# EAGLE design Monitor (EAGLE 7.7.0)

## Sheet 1 of 2
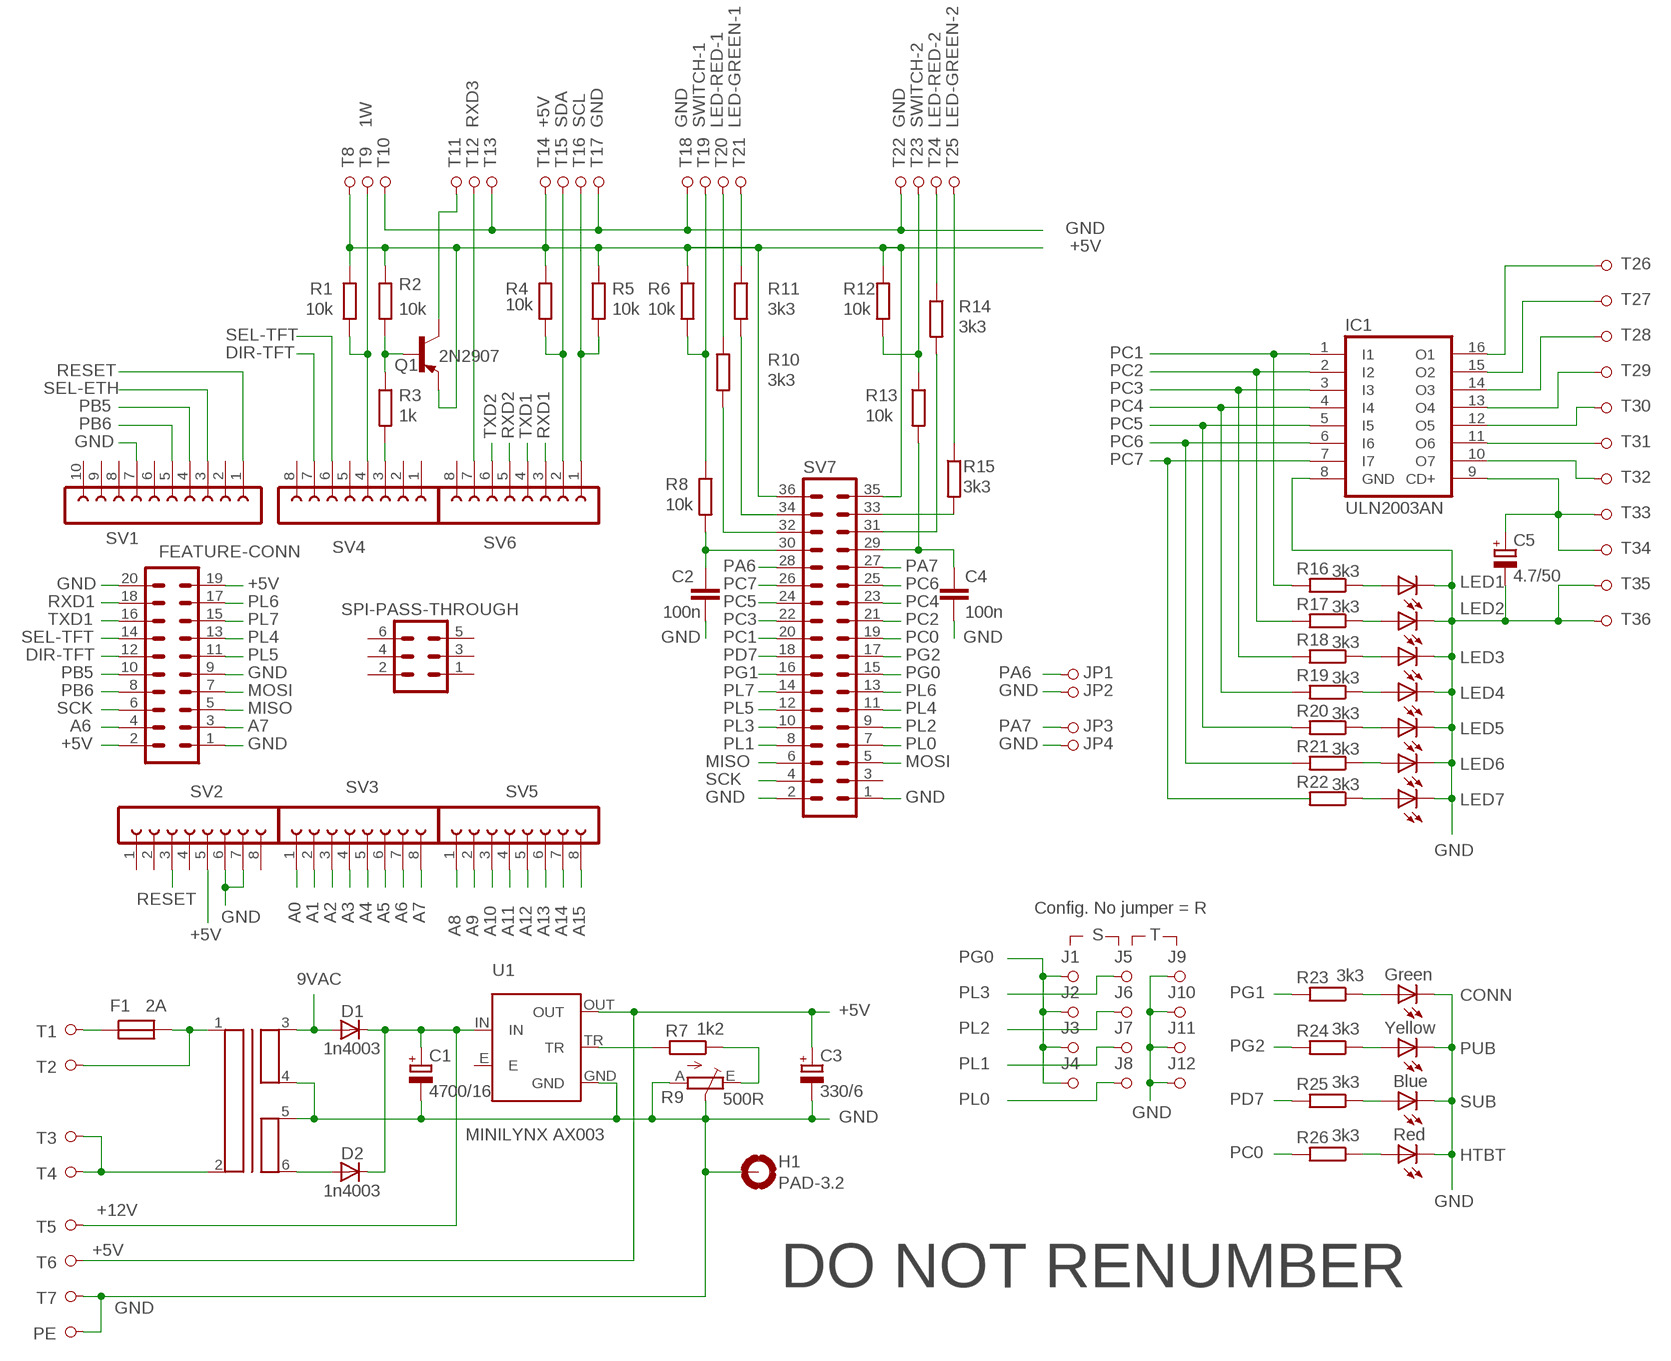
[diagram p0: schematic, sheet 1]

### Parts
C1  4700/16  CPOL-EUE7.5-16  [E7,5-16]
C2  100n  C-EU050-024X044  [C050-024X044]
C3  330/6  CPOL-EUE2.5-7  [E2,5-7]
C4  100n  C-EU050-024X044  [C050-024X044]
C5  4.7/50  CPOL-EUE5-5  [E5-5]
CONN  Green  LED3MM  [LED3MM]
D1  1n4003  1N4148  [DO34Z7]
D2  1n4003  1N4148  [DO34Z7]
F1  2A  FX0456-ZEKERING  [FX0456]
FEATURE-CONN  PINHD-10X2  [MA10-2]
H1  PAD-3.2  MOUNT-PAD-ROUND3.2  [3,2-PAD]
HTBT  Red  LED3MM  [LED3MM]
IC1  ULN2003AN  [DIL16]
J1  PINHDR-1X1  [HDR1X1]
J2  PINHDR-1X1  [HDR1X1]
J3  PINHDR-1X1  [HDR1X1]
J4  PINHDR-1X1  [HDR1X1]
J5  PINHDR-1X1  [HDR1X1]
J6  PINHDR-1X1  [HDR1X1]
J7  PINHDR-1X1  [HDR1X1]
J8  PINHDR-1X1  [HDR1X1]
J9  PINHDR-1X1  [HDR1X1]
J10  PINHDR-1X1  [HDR1X1]
J11  PINHDR-1X1  [HDR1X1]
J12  PINHDR-1X1  [HDR1X1]
JP1  PINHDR-1X1  [HDR1X1]
JP2  PINHDR-1X1  [HDR1X1]
JP3  PINHDR-1X1  [HDR1X1]
JP4  PINHDR-1X1  [HDR1X1]
LED1  LED3MM  [LED3MM]
LED2  LED3MM  [LED3MM]
LED3  LED3MM  [LED3MM]
LED4  LED3MM  [LED3MM]
LED5  LED3MM  [LED3MM]
LED6  LED3MM  [LED3MM]
LED7  LED3MM  [LED3MM]
PE  PINHDR-1X1  [HDR1X1]
PUB  Yellow  LED3MM  [LED3MM]
Q1  2N2907  PNP-TO39  [TO39]
R1  10k  R-EU_0207/10  [0207/10]
R2  10k  R-EU_0207/10  [0207/10]
R3  1k  R-EU_0207/10  [0207/10]
R4  10k  R-EU_0207/10  [0207/10]
R5  10k  R-EU_0207/10  [0207/10]
R6  10k  R-EU_0207/10  [0207/10]
R7  1k2  R-EU_0207/10  [0207/10]
R8  10k  R-EU_0207/10  [0207/10]
R9  500R  TRIMPOT-4  [TRIMPOT-4]
R10  3k3  R-EU_0207/10  [0207/10]
R11  3k3  R-EU_0207/10  [0207/10]
R12  10k  R-EU_0207/10  [0207/10]
R13  10k  R-EU_0207/10  [0207/10]
R14  3k3  R-EU_0207/10  [0207/10]
R15  3k3  R-EU_0207/10  [0207/10]
R16  3k3  R-EU_0207/10  [0207/10]
R17  3k3  R-EU_0207/10  [0207/10]
R18  3k3  R-EU_0207/10  [0207/10]
R19  3k3  R-EU_0207/10  [0207/10]
R20  3k3  R-EU_0207/10  [0207/10]
R21  3k3  R-EU_0207/10  [0207/10]
R22  3k3  R-EU_0207/10  [0207/10]
R23  3k3  R-EU_0207/10  [0207/10]
R24  3k3  R-EU_0207/10  [0207/10]
R25  3k3  R-EU_0207/10  [0207/10]
R26  3k3  R-EU_0207/10  [0207/10]
SPI-PASS-THROUGH  PINHD-3X2  [MA03-2]
SUB  Blue  LED3MM  [LED3MM]
SV1  FE10-1  [FE10]
SV2  FE08-1  [FE08]
SV3  FE08-1  [FE08]
SV4  FE08-1  [FE08]
SV5  FE08-1  [FE08]
SV6  FE08-1  [FE08]
SV7  PINHD-18X2  [MA18-2]
T1  PINHDR-1X1  [HDR1X1]
T2  PINHDR-1X1  [HDR1X1]
T3  PINHDR-1X1  [HDR1X1]
T4  PINHDR-1X1  [HDR1X1]
T5  PINHDR-1X1  [HDR1X1]
T6  PINHDR-1X1  [HDR1X1]
T7  PINHDR-1X1  [HDR1X1]
T8  PINHDR-1X1  [HDR1X1]
T9  PINHDR-1X1  [HDR1X1]
T10  PINHDR-1X1  [HDR1X1]
T11  PINHDR-1X1  [HDR1X1]
T12  PINHDR-1X1  [HDR1X1]
T13  PINHDR-1X1  [HDR1X1]
T14  PINHDR-1X1  [HDR1X1]
T15  PINHDR-1X1  [HDR1X1]
T16  PINHDR-1X1  [HDR1X1]
T17  PINHDR-1X1  [HDR1X1]
T18  PINHDR-1X1  [HDR1X1]
T19  PINHDR-1X1  [HDR1X1]
T20  PINHDR-1X1  [HDR1X1]
T21  PINHDR-1X1  [HDR1X1]
T22  PINHDR-1X1  [HDR1X1]
T23  PINHDR-1X1  [HDR1X1]
T24  PINHDR-1X1  [HDR1X1]
T25  PINHDR-1X1  [HDR1X1]
T26  PINHDR-1X1  [HDR1X1]
T27  PINHDR-1X1  [HDR1X1]
T28  PINHDR-1X1  [HDR1X1]
T29  PINHDR-1X1  [HDR1X1]
T30  PINHDR-1X1  [HDR1X1]
T31  PINHDR-1X1  [HDR1X1]
T32  PINHDR-1X1  [HDR1X1]
T33  PINHDR-1X1  [HDR1X1]
T34  PINHDR-1X1  [HDR1X1]
T35  PINHDR-1X1  [HDR1X1]
T36  PINHDR-1X1  [HDR1X1]
TR1  TRAFO  [TRAFO]
U1  MINILYNX AX003  MINILYNX  [MINILYNX]

### Nets
1W: R1.2 SV4.4 T9.1(.)
9VAC: D1.A TR1.3 ; also sheet 2
+5V [power usb]: C3.+ FEATURE-CONN.2 FEATURE-CONN.19 Q1.1(E) R1.1 R2.1 R4.1 R5.1 R6.1 R12.1 SV2.5 SV7.35 SV7.36 T6.1(.) T8.1(.) T14.1(.) U1.OUT ; also sheet 2
+12V [power usb]: C1.+ D1.C D2.C T5.1(.) U1.IN ; also sheet 2
A0: SV3.1
A1: SV3.2
A2: SV3.3
A3: SV3.4
A4: SV3.5
A5: SV3.6
A6: FEATURE-CONN.4 SV3.7
A7: FEATURE-CONN.3 SV3.8
A8: SV5.1 ; also sheet 2
A9: SV5.2 ; also sheet 2
A10: SV5.3 ; also sheet 2
A11: SV5.4 ; also sheet 2
A12: SV5.5 ; also sheet 2
A13: SV5.6 ; also sheet 2
A14: SV5.7 ; also sheet 2
A15: SV5.8 ; also sheet 2
DIR-TFT: FEATURE-CONN.12 SV4.7
GND [gnd]: C1.- C2.1 C3.- C4.2 C5.- CONN.K(C) FEATURE-CONN.1 FEATURE-CONN.9 FEATURE-CONN.20 H1.B3,2(MOUNT) HTBT.K(C) IC1.8(GND) J9.1(.) J10.1(.) J11.1(.) J12.1(.) JP2.1(.) JP4.1(.) LED1.K(C) LED2.K(C) LED3.K(C) LED4.K(C) LED5.K(C) LED6.K(C) LED7.K(C) PE.1(.) PUB.K(C) R9.A R9.S1(S) R9.S2(S) SUB.K(C) SV1.7 SV2.6 SV2.7 SV7.1 SV7.2 T7.1(.) T10.1(.) T13.1(.) T17.1(.) T18.1(.) T22.1(.) T35.1(.) T36.1(.) TR1.4 TR1.5 U1.GND ; also sheet 2
LED-GREEN-1: R11.1 T21.1(.)
LED-GREEN-2: R15.1 T25.1(.)
LED-RED-1: R10.1 T20.1(.)
LED-RED-2: R14.1 T24.1(.)
MISO: FEATURE-CONN.5 SV7.6
MOSI: FEATURE-CONN.7 SV7.5
N$1: LED6.A R21.1
N$4: R11.2 SV7.34
N$5: R10.2 SV7.32
N$6: C2.2 R8.2 SV7.30
N$7: Q1.3(C) T11.1(.)
N$8: R15.2 SV7.33
N$9: R14.2 SV7.31
N$10: R7.2 U1.TR
N$11: IC1.15(O2) T27.1(.)
N$12: LED1.A R16.1
N$13: LED2.A R17.1
N$14: LED3.A R18.1
N$15: LED4.A R19.1
N$16: LED5.A R20.1
N$17: LED7.A R22.1
N$20: C5.+ IC1.9(CD+) T33.1(.) T34.1(.)
N$21: IC1.10(O7) T32.1(.)
N$22: IC1.11(O6) T31.1(.)
N$23: IC1.12(O5) T30.1(.)
N$24: IC1.13(O4) T29.1(.)
N$25: IC1.14(O3) T28.1(.)
N$26: C4.1 R13.2 SV7.29
N$27: IC1.16(O1) T26.1(.)
N$28: D2.A TR1.6
N$29: F1.P$1 T1.1(.)
N$30: F1.P$2 T2.1(.) TR1.1
N$31: T3.1(.) T4.1(.) TR1.2
N$36: CONN.A R23.1
N$42: HTBT.A R26.1
N$68 [gnd]: R7.1 R9.E
N$70: R3.2 SV4.3
N$71: Q1.2(B) R2.2 R3.1
N$72: PUB.A R24.1
N$73: R25.1 SUB.A
PA6: JP1.1(.) SV7.28
PA7: JP3.1(.) SV7.27
PB5: FEATURE-CONN.10 SV1.4
PB6: FEATURE-CONN.8 SV1.5
PC0: R26.2 SV7.19
PC1: IC1.1(I1) R16.2 SV7.20
PC2: IC1.2(I2) R17.2 SV7.21
PC3: IC1.3(I3) R18.2 SV7.22
PC4: IC1.4(I4) R19.2 SV7.23
PC5: IC1.5(I5) R20.2 SV7.24
PC6: IC1.6(I6) R21.2 SV7.25
PC7: IC1.7(I7) R22.2 SV7.26
PD7: R25.2 SV7.18
PG0: J1.1(.) J2.1(.) J3.1(.) J4.1(.) SV7.15
PG1: R23.2 SV7.16
PG2: R24.2 SV7.17
PL0: J8.1(.) SV7.7
PL1: J7.1(.) SV7.8
PL2: J6.1(.) SV7.9
PL3: J5.1(.) SV7.10
PL4: FEATURE-CONN.13 SV7.11
PL5: FEATURE-CONN.11 SV7.12
PL6: FEATURE-CONN.17 SV7.13
PL7: FEATURE-CONN.15 SV7.14
RESET: SV1.1 SV2.3
RXD1: FEATURE-CONN.18 SV6.3
RXD2: SV6.5
RXD3: SV6.7 T12.1(.)
SCK: FEATURE-CONN.6 SV7.4
SCL: R5.2 SV6.1 T16.1(.)
SDA: R4.2 SV6.2 T15.1(.)
SEL-ETH: SV1.3
SEL-TFT: FEATURE-CONN.14 SV4.6
SWITCH-1: R6.2 R8.1 T19.1(.)
SWITCH-2: R12.2 R13.1 T23.1(.)
TXD1: FEATURE-CONN.16 SV6.4
TXD2: SV6.6
Unconnected: SPI-PASS-THROUGH.1 SPI-PASS-THROUGH.2 SPI-PASS-THROUGH.3 SPI-PASS-THROUGH.4 SPI-PASS-THROUGH.5 SPI-PASS-THROUGH.6 SV1.2 SV1.6 SV1.8 SV1.9 SV1.10 SV2.1 SV2.2 SV2.4 SV2.8 SV4.1 SV4.2 SV4.5 SV4.8 SV6.8 SV7.3 U1.E

### Notes on the sheet
- Config. No jumper = R
- S | T
- DO NOT RENUMBER

## Sheet 2 of 2
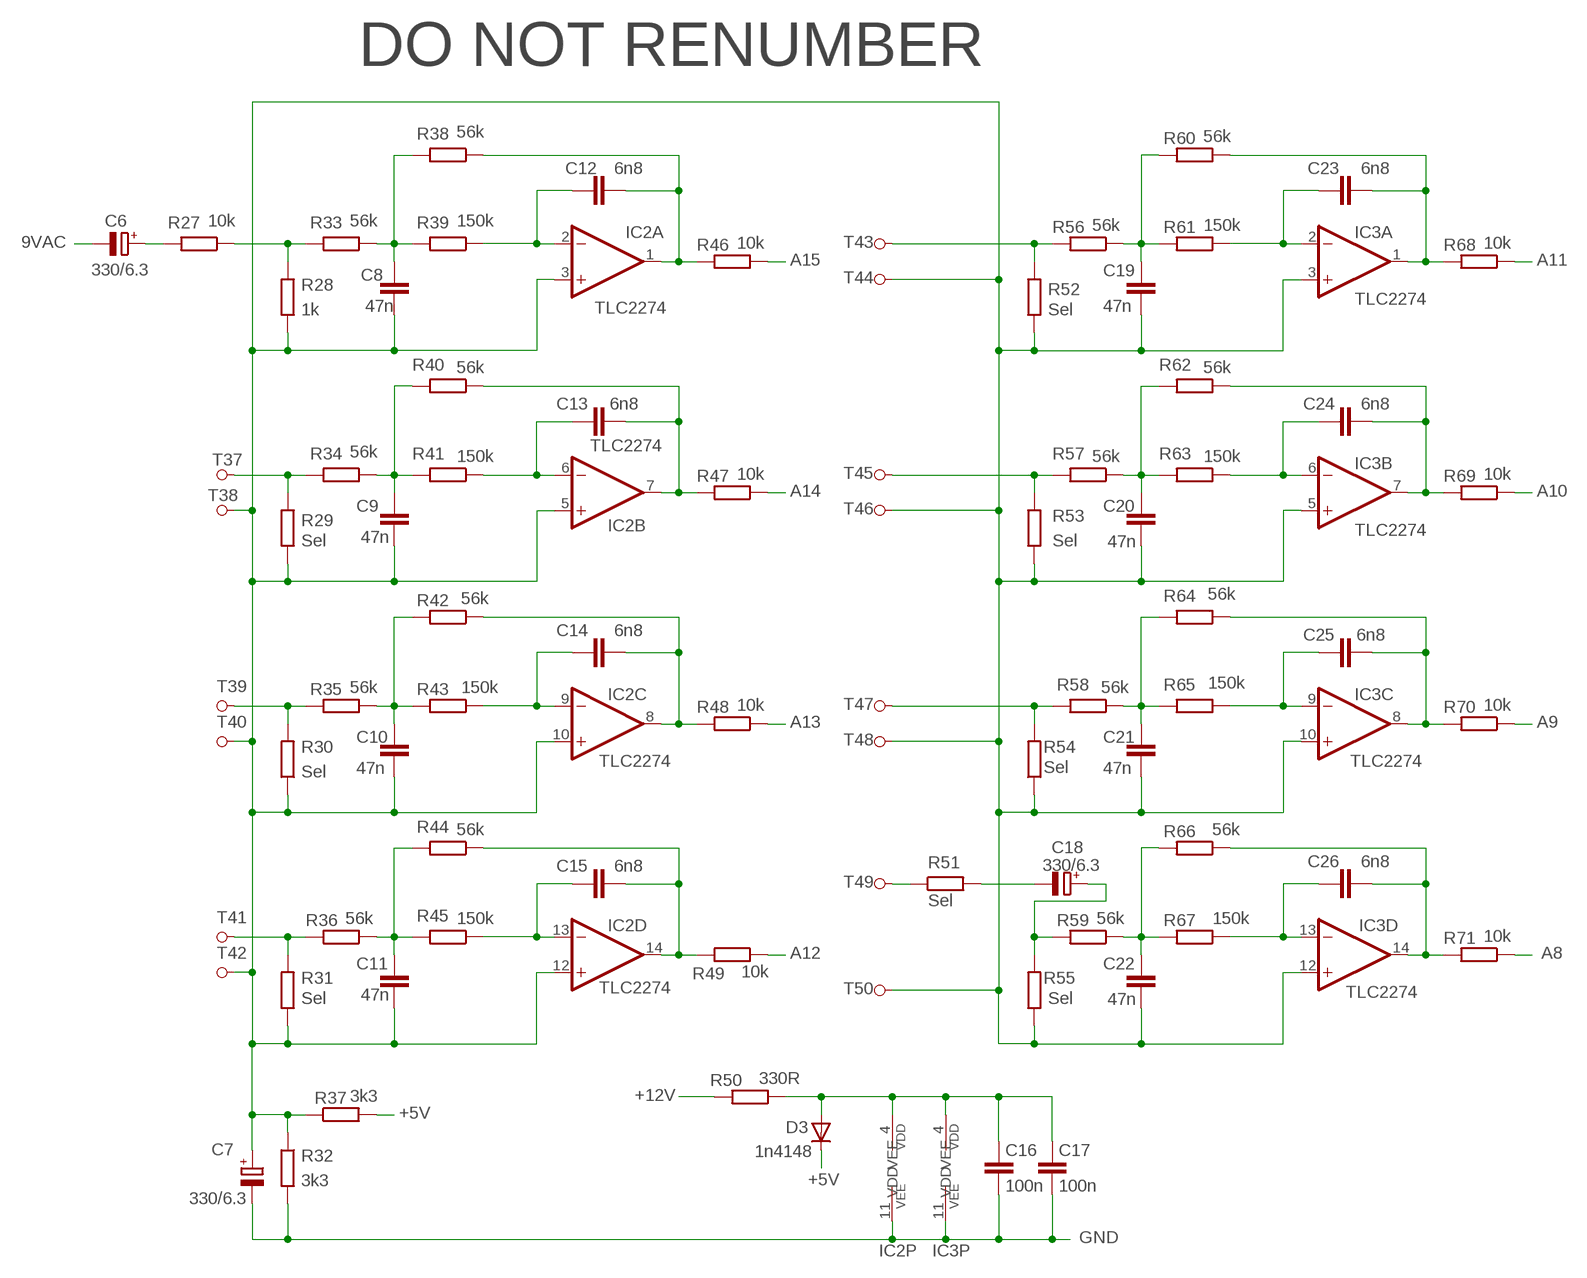
[diagram p1: schematic, sheet 2]

### Parts
C6  330/6.3  CPOL-EUE2.5-7  [E2,5-7]
C7  330/6.3  CPOL-EUE2.5-7  [E2,5-7]
C8  47n  C-EU050-025X075  [C050-025X075]
C9  47n  C-EU050-025X075  [C050-025X075]
C10  47n  C-EU050-025X075  [C050-025X075]
C11  47n  C-EU050-025X075  [C050-025X075]
C12  6n8  C-EU050-025X075  [C050-025X075]
C13  6n8  C-EU050-025X075  [C050-025X075]
C14  6n8  C-EU050-025X075  [C050-025X075]
C15  6n8  C-EU050-025X075  [C050-025X075]
C16  100n  C-EU050-024X044  [C050-024X044]
C17  100n  C-EU050-024X044  [C050-024X044]
C18  330/6.3  CPOL-EUE2.5-7  [E2,5-7]
C19  47n  C-EU050-025X075  [C050-025X075]
C20  47n  C-EU050-025X075  [C050-025X075]
C21  47n  C-EU050-025X075  [C050-025X075]
C22  47n  C-EU050-025X075  [C050-025X075]
C23  6n8  C-EU050-025X075  [C050-025X075]
C24  6n8  C-EU050-025X075  [C050-025X075]
C25  6n8  C-EU050-025X075  [C050-025X075]
C26  6n8  C-EU050-025X075  [C050-025X075]
D3  1n4148  1N4148  [DO34Z7]
IC2  TLC2274  LM124CN  [DIL14]
IC3  TLC2274  LM124CN  [DIL14]
R27  10k  R-EU_0207/10  [0207/10]
R28  1k  R-EU_0207/10  [0207/10]
R29  Sel  R-EU_0207/10  [0207/10]
R30  Sel  R-EU_0207/10  [0207/10]
R31  Sel  R-EU_0207/10  [0207/10]
R32  3k3  R-EU_0207/10  [0207/10]
R33  56k  R-EU_0207/10  [0207/10]
R34  56k  R-EU_0207/10  [0207/10]
R35  56k  R-EU_0207/10  [0207/10]
R36  56k  R-EU_0207/10  [0207/10]
R37  3k3  R-EU_0207/10  [0207/10]
R38  56k  R-EU_0207/10  [0207/10]
R39  150k  R-EU_0207/10  [0207/10]
R40  56k  R-EU_0207/10  [0207/10]
R41  150k  R-EU_0207/10  [0207/10]
R42  56k  R-EU_0207/10  [0207/10]
R43  150k  R-EU_0207/10  [0207/10]
R44  56k  R-EU_0207/10  [0207/10]
R45  150k  R-EU_0207/10  [0207/10]
R46  10k  R-EU_0207/10  [0207/10]
R47  10k  R-EU_0207/10  [0207/10]
R48  10k  R-EU_0207/10  [0207/10]
R49  10k  R-EU_0207/10  [0207/10]
R50  330R  R-EU_0207/10  [0207/10]
R51  Sel  R-EU_0207/10  [0207/10]
R52  Sel  R-EU_0207/10  [0207/10]
R53  Sel  R-EU_0207/10  [0207/10]
R54  Sel  R-EU_0207/10  [0207/10]
R55  Sel  R-EU_0207/10  [0207/10]
R56  56k  R-EU_0207/10  [0207/10]
R57  56k  R-EU_0207/10  [0207/10]
R58  56k  R-EU_0207/10  [0207/10]
R59  56k  R-EU_0207/10  [0207/10]
R60  56k  R-EU_0207/10  [0207/10]
R61  150k  R-EU_0207/10  [0207/10]
R62  56k  R-EU_0207/10  [0207/10]
R63  150k  R-EU_0207/10  [0207/10]
R64  56k  R-EU_0207/10  [0207/10]
R65  150k  R-EU_0207/10  [0207/10]
R66  56k  R-EU_0207/10  [0207/10]
R67  150k  R-EU_0207/10  [0207/10]
R68  10k  R-EU_0207/10  [0207/10]
R69  10k  R-EU_0207/10  [0207/10]
R70  10k  R-EU_0207/10  [0207/10]
R71  10k  R-EU_0207/10  [0207/10]
T37  PINHDR-1X1  [HDR1X1]
T38  PINHDR-1X1  [HDR1X1]
T39  PINHDR-1X1  [HDR1X1]
T40  PINHDR-1X1  [HDR1X1]
T41  PINHDR-1X1  [HDR1X1]
T42  PINHDR-1X1  [HDR1X1]
T43  PINHDR-1X1  [HDR1X1]
T44  PINHDR-1X1  [HDR1X1]
T45  PINHDR-1X1  [HDR1X1]
T46  PINHDR-1X1  [HDR1X1]
T47  PINHDR-1X1  [HDR1X1]
T48  PINHDR-1X1  [HDR1X1]
T49  PINHDR-1X1  [HDR1X1]
T50  PINHDR-1X1  [HDR1X1]

### Nets
9VAC: C6.- ; also sheet 1
+5V [power usb]: D3.C R37.2 ; also sheet 1
+12V [power usb]: R50.2 ; also sheet 1
A8: R71.1 ; also sheet 1
A9: R70.1 ; also sheet 1
A10: R69.1 ; also sheet 1
A11: R68.1 ; also sheet 1
A12: R49.1 ; also sheet 1
A13: R48.1 ; also sheet 1
A14: R47.1 ; also sheet 1
A15: R46.1 ; also sheet 1
GND [gnd]: C7.- C16.2 C17.2 IC2.11(P:VEE) IC3.11(P:VEE) R32.2 ; also sheet 1
N$2: R27.1 R28.2 R33.2
N$3: R30.2 R35.2 T39.1(.)
N$18: R31.2 R36.2 T41.1(.)
N$19: C6.+ R27.2
N$32: R51.1 T49.1(.)
N$33: C18.- R51.2
N$34: C8.1 R33.1 R38.2 R39.2
N$35: C9.1 R34.1 R40.2 R41.2
N$37: C12.1 IC2.2(A:-IN) R39.1
N$38: C13.1 IC2.6(B:-IN) R41.1
N$39: C7.+ C8.2 C9.2 C10.2 C11.2 C19.2 C20.2 C21.2 C22.2 IC2.3(A:+IN) IC2.5(B:+IN) IC2.10(C:+IN) IC2.12(D:+IN) IC3.3(A:+IN) IC3.5(B:+IN) IC3.10(C:+IN) IC3.12(D:+IN) R28.1 R29.1 R30.1 R31.1 R32.1 R37.1 R52.1 R53.1 R54.1 R55.1 T38.1(.) T40.1(.) T42.1(.) T44.1(.) T46.1(.) T48.1(.) T50.1(.)
N$40: C14.2 IC2.8(C:OUT) R42.1 R48.2
N$41: C12.2 IC2.1(A:OUT) R38.1 R46.2
N$43: C19.1 R56.1 R60.2 R61.2
N$44: C10.1 R35.1 R42.2 R43.2
N$45: C23.1 IC3.2(A:-IN) R61.1
N$46: C15.2 IC2.14(D:OUT) R44.1 R49.2
N$47: C20.1 R57.1 R62.2 R63.2
N$48: C14.1 IC2.9(C:-IN) R43.1
N$49: C24.1 IC3.6(B:-IN) R63.1
N$50: C11.1 R36.1 R44.2 R45.2
N$51: C24.2 IC3.7(B:OUT) R62.1 R69.2
N$52: C21.1 R58.1 R64.2 R65.2
N$53: C15.1 IC2.13(D:-IN) R45.1
N$55: C25.2 IC3.8(C:OUT) R64.1 R70.2
N$56: C25.1 IC3.9(C:-IN) R65.1
N$57: C22.1 R59.1 R66.2 R67.2
N$58: C26.1 IC3.13(D:-IN) R67.1
N$59: C26.2 IC3.14(D:OUT) R66.1 R71.2
N$60: R53.2 R57.2 T45.1(.)
N$61: R52.2 R56.2 T43.1(.)
N$62: R54.2 R58.2 T47.1(.)
N$63: C18.+ R55.2 R59.2
N$64: C16.1 C17.1 D3.A IC2.4(P:VDD) IC3.4(P:VDD) R50.1
N$65: C23.2 IC3.1(A:OUT) R60.1 R68.2
N$66: R29.2 R34.2 T37.1(.)
N$67: C13.2 IC2.7(B:OUT) R40.1 R47.2

### Notes on the sheet
- DO NOT RENUMBER

## Library data of the parts
C1 C3 C5-C7 C18 = Passive:CPOL-EU: POLARIZED CAPACITOR, European symbol
C2 C4 C8-C17 C19-C26 = Passive:C-EU: CAPACITOR, European symbol
CONN HTBT LED1-LED7 PUB SUB = Opto:LED: LED OSRAM: - CHIPLED LG R971, LG N971, LY N971, LG Q971, LY Q971, LO R971, LY R971 LH N974, LH R974 LS Q976, LO Q976, LY Q976 LO Q996 - Hyper CHIPLED LW Q18S LB Q993, LB Q99A, LB R99A - SideLED LS A670, LO A670, LY A670, LG A670, LP A670 LB A673, LV A673, LT A673, LW A673 LH A674 LY A675 LS A676, LA A676, LO A676, LY A676, LW A676 LS A679, LY A679, LG A679 - Hyper Micro SIDELED® LS Y876, LA Y876, LO Y876, LY Y876 LT Y87S - SmartLED LW L88C, LW L88S LB L89C, LB L89S, LG L890 LS L89K, LO L89K, LY L89K LS L896, LA L896, LO L896, LY L896 - TOPLED LS T670, LO T670, LY T670, LG T670, LP T670 LSG T670, LSP T670, LSY T670, LOP T670, LYG T670 LG T671, LOG T671, LSG T671 LB T673, LV T673, LT T673, LW T673 LH T674 LS T676, LA T676, LO T676, LY T676, LB T676, LH T676, LSB T676, LW T676 LB T67C, LV T67C, LT T67C, LS T67K, LO T67K, LY T67K, LW E67C LS E67B, LA E67B, LO E67B, LY E67B, LB E67C, LV E67C, LT E67C LW T67C LS T679, LY T679, LG T679 LS T770, LO T770, LY T770, LG T770, LP T770 LB T773, LV T773, LT T773, LW T773 LH T774 LS E675, LA E675, LY E675, LS T675 LS T776, LA T776, LO T776, LY T776, LB T776 LHGB T686 LT T68C, LB T68C - Hyper Mini TOPLED® LB M676 - Mini TOPLED Santana® LG M470 LS M47K, LO M47K, LY M47K Source: http://www.osram.convergy.de LUXEON: - LUMILED® LXK2-PW12-R00, LXK2-PW12-S00, LXK2-PW14-U00, LXK2-PW14-V00 LXK2-PM12-R00, LXK2-PM12-S00, LXK2-PM14-U00 LXK2-PE12-Q00, LXK2-PE12-R00, LXK2-PE12-S00, LXK2-PE14-T00, LXK2-PE14-U00 LXK2-PB12-K00, LXK2-PB12-L00, LXK2-PB12-M00, LXK2-PB14-N00, LXK2-PB14-P00, LXK2-PB14-Q00 LXK2-PR12-L00, LXK2-PR12-M00, LXK2-PR14-Q00, LXK2-PR14-R00 LXK2-PD12-Q00, LXK2-PD12-R00, LXK2-PD12-S00 LXK2-PH12-R00, LXK2-PH12-S00 LXK2-PL12-P00, LXK2-PL12-Q00, LXK2-PL12-R00 Source: www.luxeon.com KINGBRIGHT: KA-3528ASYC Source: www.kingbright.com
D1-D3 = DiodeRect:1N4148
F1 = Passive:FX0456-ZEKERING
FEATURE-CONN = Header:PINHD-10X2: PIN HEADER
H1 = Holes:MOUNT-PAD-ROUND: MOUNTING PAD, round
IC1 = IC_Interface:ULN2003A: DRIVER ARRAY
IC2 IC3 = IC_Lin:LM124: Quad Op Amp
J1-J12 JP1-JP4 PE T1-T50 = Header:PINHDR-1X1
Q1 = Trans:PNP: PNP Transistror
R1-R8 R10-R71 = Passive:R-EU_: RESISTOR, European symbol
R9 = Passive:TRIMPOT-4
SPI-PASS-THROUGH = Header:PINHD-3X2: PIN HEADER
SV1 = Header:FE10-1: FEMALE HEADER
SV2-SV6 = Header:FE08-1: FEMALE HEADER
SV7 = Header:PINHD-18X2: PIN HEADER
TR1 = Passive:TRAFO
U1 = Regulator:MINILYNX: Minilynx DC-DC 12 - 5var NON-ISO

## Net classes
1 power: width 0.61 mm, drill 0.406 mm, clearance 0.203 mm
2 gnd: width 0.305 mm, drill 0.406 mm, clearance 0.203 mm
3 power usb: width 0.508 mm, drill 0.406 mm, clearance 0.203 mm
4 vcc2: width 0.914 mm, drill 0.305 mm, clearance 0.305 mm

## Board
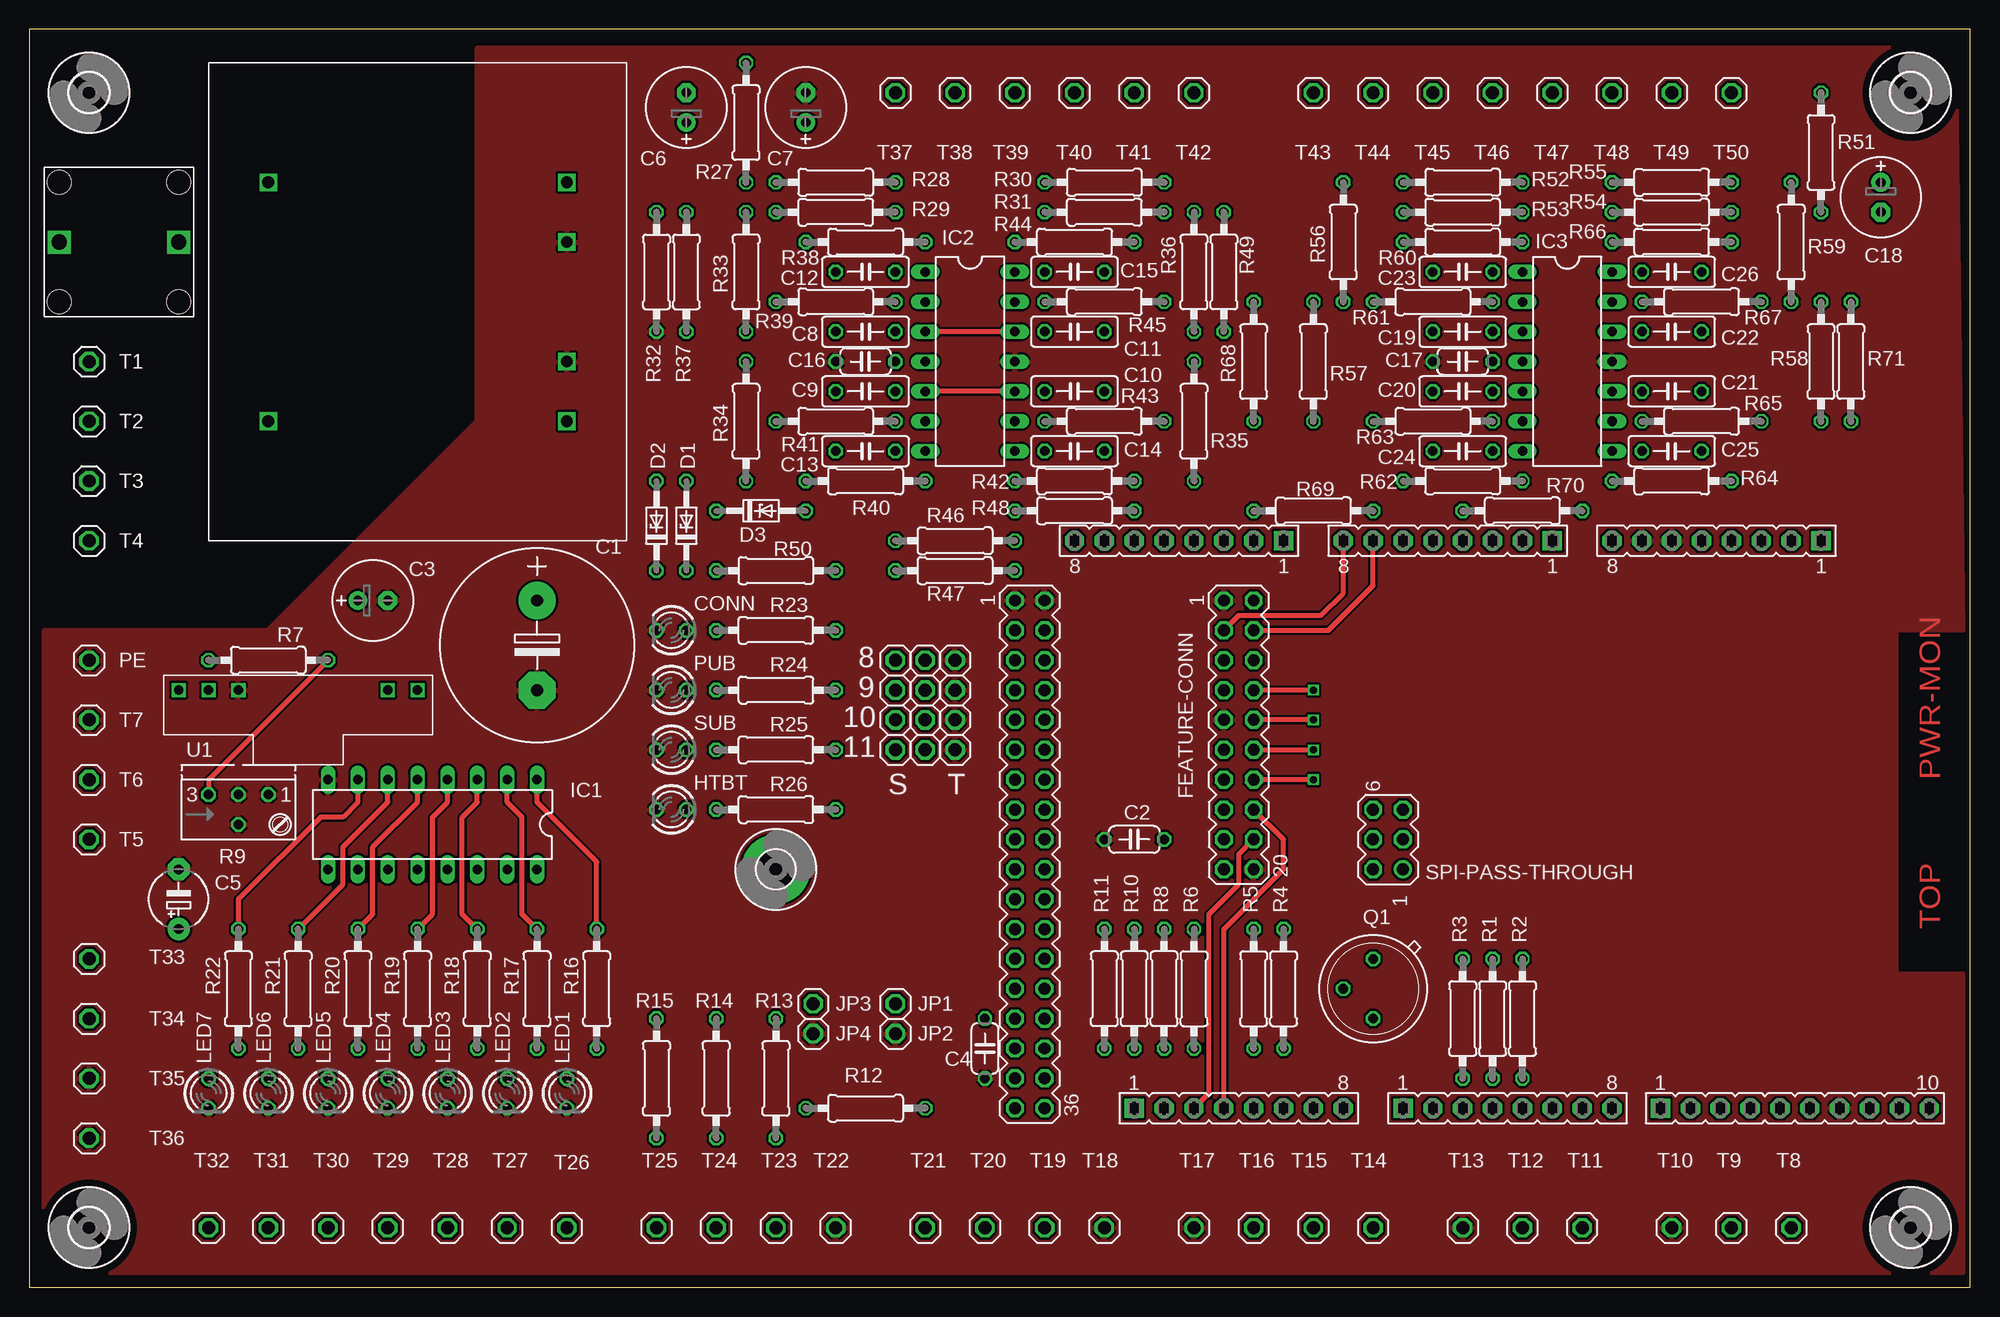
[diagram p2: board, top side]
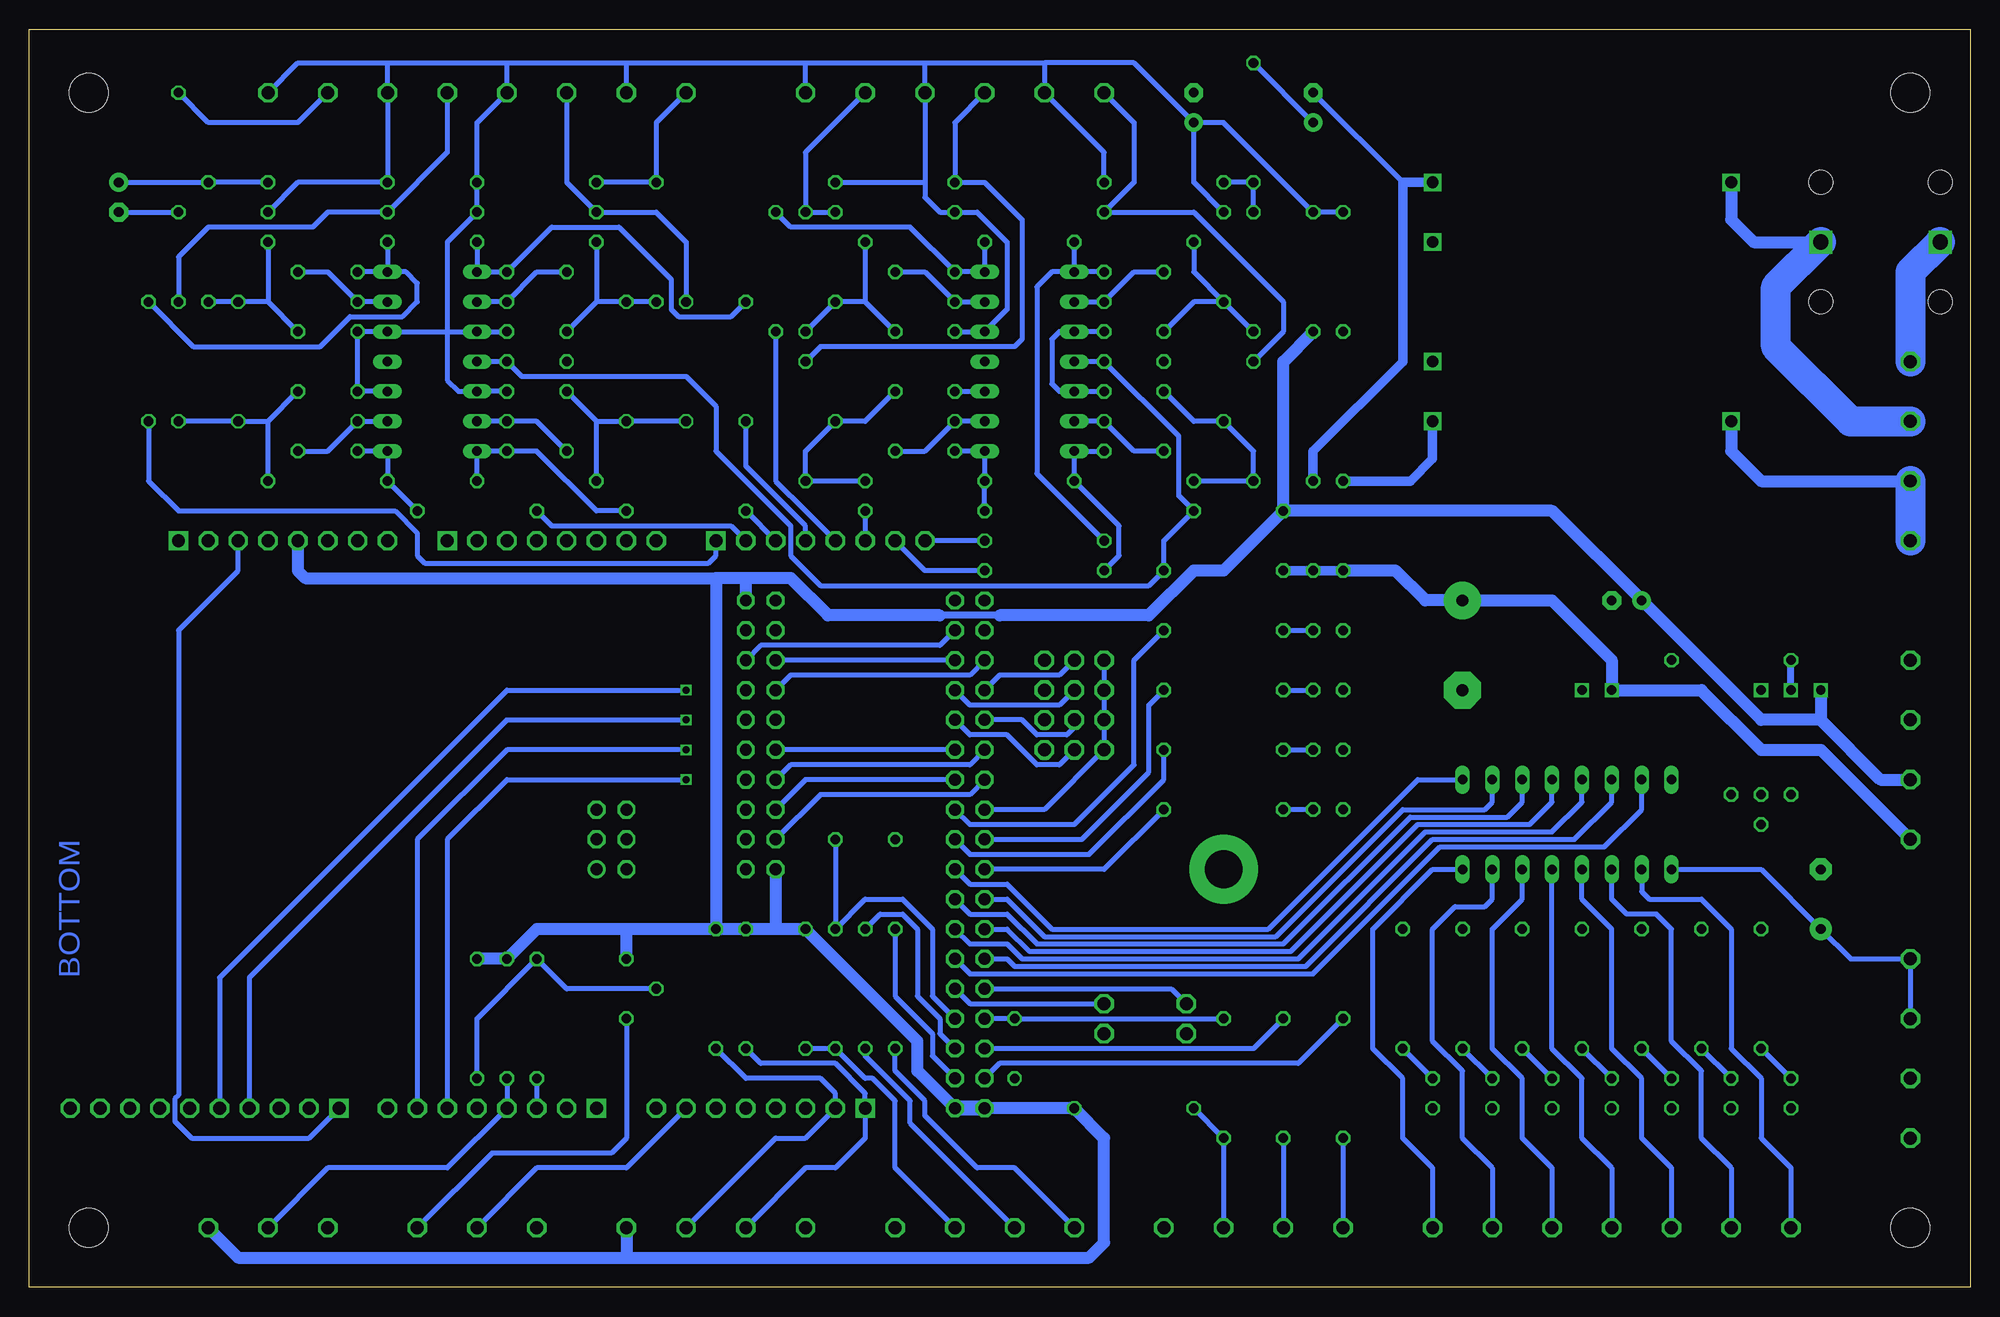
[diagram p3: board, bottom side, seen from below]

Size 165.08 x 106.98 mm. Coordinates in mm from the lower left corner, seen from the top.
Outline: 0,0 165.08,0 165.08,106.98 0,106.98 0,0
Copper layers (1*16): Top 0.018mm / dielectric 1.55mm / Bottom 0.018mm
Design rules "eC_2Layer_PClass6_BaseCopperO18_eCDefault *": minimum track width 0.15mm, minimum drill 0.35mm, track to track 0.15mm, track to pad 0.15mm, pad to pad 0.15mm, via to via 0.15mm, smd to smd 0mil, copper to edge 0.25mm, drill to drill 0.35mm, minimum pad ring 0.175mm, minimum via ring 0.125mm, stop-mask expansion 0mil, vias tented up to drill 0.45mm, thermal gap 0.2mm

### Footprints (pad centres in the part's own frame; a part is rotated, then mirrored left to right if it is on the bottom)
E7,5-16 = drill 1.016 pad 3.15: + -3.81,0 | drill 1.016 pad 3.15 octagon: - 3.81,0
C050-024X044 = drill 0.813 octagon: 1 -2.54,0; 2 2.54,0
E2,5-7 = drill 0.813 pad 1.6: + -1.27,0 | drill 0.813 pad 1.6 octagon: - 1.27,0
E5-5 = drill 0.813 pad 1.905: + -2.54,0 | drill 0.813 pad 1.905 octagon: - 2.54,0
C050-025X075 = drill 0.813 octagon: 1 -2.54,0; 2 2.54,0
LED3MM = drill 0.813 octagon: A -1.27,0; K 1.27,0
DO34Z7 = drill 0.813 octagon: A 3.81,0; C -3.81,0
FX0456 = drill 1.3 square: P$1 0,5.08; P$2 0,-5.08 | hole 2: -5.08,5.08; -5.08,-5.08; 5.08,-5.08; 5.08,5.08
MA10-2 = drill 1.016 octagon: 1 -11.43,-1.27; 2 -11.43,1.27; 3 -8.89,-1.27; 4 -8.89,1.27; 5 -6.35,-1.27; 6 -6.35,1.27; 7 -3.81,-1.27; 8 -3.81,1.27; 9 -1.27,-1.27; 10 -1.27,1.27; 11 1.27,-1.27; 12 1.27,1.27; 13 3.81,-1.27; 14 3.81,1.27; 15 6.35,-1.27; 16 6.35,1.27; 17 8.89,-1.27; 18 8.89,1.27; 19 11.43,-1.27; 20 11.43,1.27
3,2-PAD = drill 3.2 pad 5.842: B3,2 0,0
DIL16 = drill 0.813 long: 1 -8.89,-3.81; 2 -6.35,-3.81; 3 -3.81,-3.81; 4 -1.27,-3.81; 5 1.27,-3.81; 6 3.81,-3.81; 7 6.35,-3.81; 8 8.89,-3.81; 9 8.89,3.81; 10 6.35,3.81; 11 3.81,3.81; 12 1.27,3.81; 13 -1.27,3.81; 14 -3.81,3.81; 15 -6.35,3.81; 16 -8.89,3.81
DIL14 = drill 0.813 long: 1 -7.62,-3.81; 2 -5.08,-3.81; 3 -2.54,-3.81; 4 0,-3.81; 5 2.54,-3.81; 6 5.08,-3.81; 7 7.62,-3.81; 8 7.62,3.81; 9 5.08,3.81; 10 2.54,3.81; 11 0,3.81; 12 -2.54,3.81; 13 -5.08,3.81; 14 -7.62,3.81
HDR1X1 = drill 1.1 octagon: 1 0,0
TO39 = drill 0.813 octagon: 1 0,-2.54; 2 2.54,0; 3 0,2.54
0207/10 = drill 0.813 octagon: 1 -5.08,0; 2 5.08,0
TRIMPOT-4 = drill 0.813 octagon: A 2.54,1.27; E -2.54,1.27; S1 0,1.27; S2 0,-1.27
MA03-2 = drill 1.016: 1 -2.54,-1.27 | drill 1.016 octagon: 2 -2.54,1.27; 3 0,-1.27; 4 0,1.27; 5 2.54,-1.27; 6 2.54,1.27
FE10 = drill 1.1 square: 1 -11.43,0 | drill 1.1 octagon: 2 -8.89,0; 3 -6.35,0; 4 -3.81,0; 5 -1.27,0; 6 1.27,0; 7 3.81,0; 8 6.35,0; 9 8.89,0; 10 11.43,0
FE08 = drill 1.1 square: 1 -8.89,0 | drill 1.1 octagon: 2 -6.35,0; 3 -3.81,0; 4 -1.27,0; 5 1.27,0; 6 3.81,0; 7 6.35,0; 8 8.89,0
MA18-2 = drill 1.016 octagon: 1 -21.59,-1.27; 2 -21.59,1.27; 3 -19.05,-1.27; 4 -19.05,1.27; 5 -16.51,-1.27; 6 -16.51,1.27; 7 -13.97,-1.27; 8 -13.97,1.27; 9 -11.43,-1.27; 10 -11.43,1.27; 11 -8.89,-1.27; 12 -8.89,1.27; 13 -6.35,-1.27; 14 -6.35,1.27; 15 -3.81,-1.27; 16 -3.81,1.27; 17 -1.27,-1.27; 18 -1.27,1.27; 19 1.27,-1.27; 20 1.27,1.27; 21 3.81,-1.27; 22 3.81,1.27; 23 6.35,-1.27; 24 6.35,1.27; 25 8.89,-1.27; 26 8.89,1.27; 27 11.43,-1.27; 28 11.43,1.27; 29 13.97,-1.27; 30 13.97,1.27; 31 16.51,-1.27; 32 16.51,1.27; 33 19.05,-1.27; 34 19.05,1.27; 35 21.59,-1.27; 36 21.59,1.27
TRAFO = drill 1 square: 1 -12.7,10.16; 2 -12.7,-10.16; 3 12.7,10.16; 4 12.7,5.08; 5 12.7,-5.08; 6 12.7,-10.16
MINILYNX = drill 0.8 square: E 10.16,2.54; GND -5.08,2.54; IN 7.62,2.54; OUT -10.16,2.54; TR -7.62,2.54
3,3 = hole 3.3: 0,0

### Placement (x,y rotation side)
C1  43.18,54.61 270 top
C2  93.98,38.1 0 top
C3  29.21,58.42 0 top
C4  81.28,20.32 270 top
C5  12.7,33.02 90 top
C6  55.88,100.33 90 top
C7  66.04,100.33 90 top
C8  71.12,81.28 0 top
C9  71.12,76.2 0 top
C10  88.9,76.2 180 top
C11  88.9,81.28 180 top
C12  71.12,86.36 0 top
C13  71.12,71.12 0 top
C14  88.9,71.12 180 top
C15  88.9,86.36 180 top
C16  71.12,78.74 180 top
C17  121.92,78.74 180 top
C18  157.48,92.71 270 top
C19  121.92,81.28 0 top
C20  121.92,76.2 0 top
C21  139.7,76.2 180 top
C22  139.7,81.28 180 top
C23  121.92,86.36 0 top
C24  121.92,71.12 0 top
C25  139.7,71.12 180 top
C26  139.7,86.36 180 top
CONN  54.61,55.88 180 top
D1  55.88,64.77 90 top
D2  53.34,64.77 90 top
D3  62.23,66.04 0 top
F1  7.62,88.9 90 top
FEATURE-CONN  102.87,46.99 270 top
H1  63.5,35.56 0 top
HTBT  54.61,40.64 180 top
IC1  34.29,39.37 180 top
IC2  80.01,78.74 270 top
IC3  130.81,78.74 270 top
J1  73.66,53.34 0 top
J2  73.66,50.8 0 top
J3  73.66,48.26 0 top
J4  73.66,45.72 0 top
J5  76.2,45.72 0 top
J6  76.2,48.26 0 top
J7  76.2,50.8 0 top
J8  76.2,53.34 0 top
J9  78.74,45.72 0 top
J10  78.74,48.26 0 top
J11  78.74,50.8 0 top
J12  78.74,53.34 0 top
JP1  73.66,24.13 0 top
JP2  73.66,21.59 0 top
JP3  66.68,24.13 0 top
JP4  66.68,21.59 0 top
LED1  45.72,16.51 270 top
LED2  40.64,16.51 270 top
LED3  35.56,16.51 270 top
LED4  30.48,16.51 270 top
LED5  25.4,16.51 270 top
LED6  20.32,16.51 270 top
LED7  15.24,16.51 270 top
PE  5.08,53.34 0 top
PUB  54.61,50.8 180 top
Q1  114.3,25.4 180 top
R1  124.46,22.86 270 top
R2  127,22.86 270 top
R3  121.92,22.86 270 top
R4  106.68,25.4 270 top
R5  104.14,25.4 270 top
R6  99.06,25.4 270 top
R7  20.32,53.34 180 top
R8  96.52,25.4 90 top
R9  17.78,40.64 0 top
R10  93.98,25.4 90 top
R11  91.44,25.4 90 top
R12  71.12,15.24 180 top
R13  63.5,17.78 90 top
R14  58.42,17.78 90 top
R15  53.34,17.78 90 top
R16  48.26,25.4 90 top
R17  43.18,25.4 90 top
R18  38.1,25.4 90 top
R19  33.02,25.4 90 top
R20  27.94,25.4 90 top
R21  22.86,25.4 90 top
R22  17.78,25.4 90 top
R23  63.5,55.88 0 top
R24  63.5,50.8 0 top
R25  63.5,45.72 0 top
R26  63.5,40.64 0 top
R27  60.96,99.06 90 top
R28  68.58,93.98 180 top
R29  68.58,91.44 0 top
R30  91.44,93.98 180 top
R31  91.44,91.44 0 top
R32  53.34,86.36 270 top
R33  60.96,86.36 90 top
R34  60.96,73.66 90 top
R35  99.06,73.66 90 top
R36  99.06,86.36 90 top
R37  55.88,86.36 270 top
R38  71.12,88.9 180 top
R39  68.58,83.82 180 top
R40  71.12,68.58 180 top
R41  68.58,73.66 180 top
R42  88.9,68.58 0 top
R43  91.44,73.66 0 top
R44  88.9,88.9 0 top
R45  91.44,83.82 0 top
R46  78.74,63.5 180 top
R47  78.74,60.96 180 top
R48  88.9,66.04 180 top
R49  101.6,86.36 90 top
R50  63.5,60.96 180 top
R51  152.4,96.52 270 top
R52  121.92,93.98 180 top
R53  121.92,91.44 180 top
R54  139.7,91.44 180 top
R55  139.7,93.98 0 top
R56  111.76,88.9 90 top
R57  109.22,78.74 90 top
R58  152.4,78.74 90 top
R59  149.86,88.9 90 top
R60  121.92,88.9 180 top
R61  119.38,83.82 180 top
R62  121.92,68.58 180 top
R63  119.38,73.66 180 top
R64  139.7,68.58 0 top
R65  142.24,73.66 0 top
R66  139.7,88.9 0 top
R67  142.24,83.82 0 top
R68  104.14,78.74 90 top
R69  109.22,66.04 0 top
R70  127,66.04 0 top
R71  154.94,78.74 90 top
SPI-PASS-THROUGH  115.57,38.1 90 top
SUB  54.61,45.72 180 top
SV1  150.18,15.24 0 top
SV2  143.51,63.5 180 top
SV3  120.65,63.5 180 top
SV4  125.73,15.24 0 top
SV5  97.79,63.5 180 top
SV6  102.87,15.24 0 top
SV7  85.09,36.83 270 top
T1  5.08,78.74 0 top
T2  5.08,73.66 0 top
T3  5.08,68.58 0 top
T4  5.08,63.5 0 top
T5  5.08,38.1 0 top
T6  5.08,43.18 0 top
T7  5.08,48.26 0 top
T8  149.86,5.08 0 top
T9  144.78,5.08 0 top
T10  139.7,5.08 0 top
T11  132.08,5.08 0 top
T12  127,5.08 0 top
T13  121.92,5.08 0 top
T14  114.3,5.08 0 top
T15  109.22,5.08 0 top
T16  104.14,5.08 0 top
T17  99.06,5.08 0 top
T18  91.44,5.08 0 top
T19  86.36,5.08 0 top
T20  81.28,5.08 0 top
T21  76.2,5.08 0 top
T22  68.58,5.08 0 top
T23  63.5,5.08 0 top
T24  58.42,5.08 0 top
T25  53.34,5.08 0 top
T26  45.72,5.08 0 top
T27  40.64,5.08 0 top
T28  35.56,5.08 0 top
T29  30.48,5.08 0 top
T30  25.4,5.08 0 top
T31  20.32,5.08 0 top
T32  15.24,5.08 0 top
T33  5.08,27.94 0 top
T34  5.08,22.86 0 top
T35  5.08,17.78 0 top
T36  5.08,12.7 0 top
T37  73.66,101.6 0 top
T38  78.74,101.6 0 top
T39  83.82,101.6 0 top
T40  88.9,101.6 0 top
T41  93.98,101.6 0 top
T42  99.06,101.6 0 top
T43  109.22,101.6 0 top
T44  114.3,101.6 0 top
T45  119.38,101.6 0 top
T46  124.46,101.6 0 top
T47  129.54,101.6 0 top
T48  134.62,101.6 0 top
T49  139.7,101.6 0 top
T50  144.78,101.6 0 top
TR1  33.02,83.82 0 top
U1  22.86,48.26 0 top
U$2  [3,3]  5.08,101.6 0 top
U$3  [3,3]  5.08,5.08 0 top
U$4  [3,3]  160.02,101.6 0 top
U$5  [3,3]  160.02,5.08 0 top

### Tracks (layer width: path | path; a pad name or v marks a point on that pad's centre or on a via)
1W
  Bottom 0.406: R1.2 SV4.4 129.54,10.16 139.7,10.16 T9.1
9VAC
  Bottom 0.406: C6.- 48.26,93.98
  Bottom 0.813: TR1.3 48.26,93.98 48.26,78.74 55.88,71.12 D1.A
+5V
  Bottom 0.61: 82.55,57.15 87.63,57.15
  Bottom 1.016: SV7.36 89.54,18.41 89.54,20.95 R6.1 101.6,30.48 | 114.3,2.54 147.32,2.54 T8.1 | 114.3,2.54 74.93,2.54 73.66,3.81 73.66,12.7 R12.1 SV7.35 | 101.6,30.48 R5.1 R4.1 | R4.1 114.3,30.48 | Q1.1 114.3,30.48 | 114.3,30.48 121.92,30.48 R1.1 R2.1 | D3.C 58.42,78.74 R37.2 | D3.C 63.5,60.96 66.04,60.96 69.85,57.15 82.55,57.15 | SV2.5 142.24,60.96 141.6,60.32 106.68,60.32 | 87.63,57.15 97.16,57.15 100.33,60.32 104.14,60.32 | 104.14,60.32 106.68,60.32 | 106.68,60.32 R4.1 | D3.C 35.56,66.04 C3.+ 17.78,48.26 12.7,48.26 | 12.7,48.26 7.62,43.18 T6.1 | U1.OUT 12.7,48.26 | FEATURE-CONN.19 101.6,30.48 | FEATURE-CONN.2 104.14,60.32 | T14.1 114.3,2.54
  Bottom 1.27: SV7.35 SV7.36
+12V
  Bottom 0.813: D2.C D1.C R50.2
  Bottom 1.016: D2.C 48.89,60.96 46.35,58.42 C1.+ 35.56,58.42 30.48,53.34 U1.IN 22.86,50.8 17.78,45.72 12.7,45.72 10.8,43.81 T5.1
A6
  Top 0.406: FEATURE-CONN.4 110.49,55.88 114.3,59.69 SV3.7
A7
  Top 0.406: FEATURE-CONN.3 102.87,57.15 109.86,57.15 111.76,59.05 SV3.8
A8
  Bottom 0.406: R71.1 154.94,68.58 152.4,66.04 133.98,66.04 132.08,64.14 132.08,62.23 131.44,61.59 107.32,61.59 106.68,62.23 SV5.1
A9
  Bottom 0.406: R70.1 120.65,64.77 105.41,64.77 SV5.2
A10
  Bottom 0.406: R69.1 SV5.3
A11
  Bottom 0.406: SV5.4 99.06,64.77 104.14,69.85 R68.1
A12
  Bottom 0.406: R49.1 101.6,68.58 99.06,66.04 SV5.5
A13
  Bottom 0.406: R48.1 SV5.6
A14
  Bottom 0.406: R47.1 88.9,60.96 SV5.7
A15
  Bottom 0.406: R46.1 SV5.8
DIR-TFT  (via drill 0.6)
  Top 0.406: FEATURE-CONN.12 v109.22,45.72
  Bottom 0.406: v109.22,45.72 124.46,45.72 132.08,38.1 SV4.7
GND
  pour Top: 1.27,55.88 20.32,55.88 38.1,73.66 38.1,105.41 163.83,105.41 164.47,55.88 158.75,55.88 158.75,26.67 164.47,26.67 164.47,1.27 1.27,1.27
LED-GREEN-1
  Bottom 0.406: R11.1 91.44,18.41 88.9,15.88 88.9,14.61 84.46,10.16 81.28,10.16 T21.1
LED-GREEN-2
  Bottom 0.406: R15.1 T25.1
LED-RED-1
  Bottom 0.406: R10.1 93.98,19.68 90.17,15.88 90.17,13.97 T20.1
LED-RED-2
  Bottom 0.406: R14.1 T24.1
MISO
  Bottom 0.406: SV7.6 FEATURE-CONN.5
MOSI
  Bottom 0.406: SV7.5 85.09,52.07 100.33,52.07 FEATURE-CONN.7
N$1
  Bottom 0.406: LED6.A R21.1
N$2
  Bottom 0.406: R33.2 R27.1 R28.2
N$3
  Bottom 0.406: T39.1 86.36,99.06 R30.2 83.82,93.98 80.65,90.81 80.65,80.65 81.28,80.01 97.79,80.01 R35.2
N$4
  Bottom 0.406: R11.2 91.44,24.77 88.27,21.59 88.27,19.68 SV7.34
N$5
  Bottom 0.406: R10.2 92.71,31.75 90.81,31.75 89.54,30.48 89.54,24.77 87.63,22.86 87.63,21.59 SV7.32
N$6
  Bottom 0.406: C2.2 R8.2 93.98,33.02 90.81,33.02 88.27,30.48 88.27,24.77 SV7.30
N$7
  Bottom 0.406: Q1.3 114.3,12.7 115.57,11.43 125.73,11.43 T11.1
N$8
  Bottom 0.406: R15.2 57.15,19.05 82.55,19.05 SV7.33
N$9
  Bottom 0.406: R14.2 60.96,20.32 SV7.31
N$10
  Bottom 0.61: U1.TR R7.2
N$11
  Bottom 0.406: IC1.15 40.64,33.02 41.27,32.38 43.81,32.38 45.72,30.48 45.72,20.95 43.18,18.41 43.18,12.7 40.64,10.16 T27.1
N$12
  Bottom 0.406: LED1.A R16.1
N$13
  Bottom 0.406: LED2.A R17.1
N$14
  Bottom 0.406: LED3.A R18.1
N$15
  Bottom 0.406: LED4.A R19.1
N$16
  Bottom 0.406: LED5.A R20.1
N$17
  Bottom 0.406: LED7.A R22.1
N$18
  Bottom 0.406: R31.2 R36.2 99.06,96.52 T41.1
N$19
  Bottom 0.406: R27.2 C6.+
N$20
  Bottom 0.406: IC1.9 17.78,35.56 C5.+ 10.16,27.94 T33.1 T34.1
N$21
  Bottom 0.406: IC1.10 27.94,33.66 27.3,33.02 22.86,33.02 20.32,30.48 20.32,20.32 17.78,17.78 17.78,12.7 15.24,10.16 T32.1
N$22
  Bottom 0.406: IC1.11 30.48,33.02 29.21,31.75 26.67,31.75 25.4,30.48 25.4,20.95 22.86,18.41 22.86,12.7 20.32,10.16 T31.1
N$23
  Bottom 0.406: IC1.12 33.02,33.02 30.48,30.48 30.48,20.32 27.94,17.78 27.94,12.7 25.4,10.16 T30.1
N$24
  Bottom 0.406: IC1.13 35.56,20.32 33.02,17.78 33.02,12.7 30.48,10.16 T29.1
N$25
  Bottom 0.406: IC1.14 38.1,33.02 40.64,30.48 40.64,20.32 38.1,17.78 38.1,12.7 35.56,10.16 T28.1
N$26
  Bottom 0.406: SV7.29 C4.1 R13.2
N$27
  Bottom 0.406: IC1.16 45.72,35.56 50.8,30.48 50.8,20.32 48.26,17.78 48.26,12.7 45.72,10.16 T26.1
N$28
  Bottom 0.813: TR1.6 45.72,70.48 47.62,68.58 D2.A
N$29
  Bottom 2.54: F1.P$1 5.08,86.36 T1.1
N$30
  Bottom 1.016: TR1.1 20.32,90.81 18.41,88.9 F1.P$2
  Bottom 2.54: F1.P$2 16.51,85.09 16.51,80.01 10.16,73.66 T2.1
N$31
  Bottom 1.016: TR1.2 20.32,71.12 17.78,68.58 T3.1
  Bottom 2.54: T3.1 T4.1
N$32
  Bottom 0.406: T49.1 142.24,99.06 149.86,99.06 R51.1
N$33
  Bottom 0.406: C18.- R51.2
N$34
  Bottom 0.406: R38.2 66.04,86.36 R39.2 | C8.1 66.04,83.82 R39.2 | R33.1 R39.2
N$35
  Bottom 0.406: C9.1 66.04,73.66 R41.2 60.96,71.12 R34.1 R40.2
N$36
  Bottom 0.406: R23.1 CONN.A
N$37
  Bottom 0.406: IC2.2 R39.1 71.12,86.36 C12.1
N$38
  Bottom 0.406: C13.1 71.12,71.12 R41.1 IC2.6
N$39
  Top 0.406: IC2.12 IC2.3 | IC2.10 IC2.5
  Bottom 0.406: R32.1 R37.1 63.5,99.06 C7.+ | T50.1 142.24,104.14 134.62,104.14 | 134.62,104.14 124.46,104.14 | 124.46,104.14 114.3,104.14 | 114.3,104.14 99.06,104.14 | 99.06,104.14 88.9,104.14 | 88.9,104.14 78.74,104.14 | C7.+ 71.12,104.14 78.74,104.14 | 78.74,104.14 T38.1 73.66,96.52 R28.1 | 88.9,104.14 T40.1 88.9,93.98 | T42.1 99.06,104.14 | T44.1 114.3,104.14 | 124.46,104.14 T46.1 127,99.06 R52.1 R53.1 129.54,88.9 129.54,81.28 | 134.62,104.14 T48.1 R55.1 142.24,93.98 R54.1 | R29.1 66.04,93.98 C7.+ | 88.9,93.98 88.9,92.71 87.63,91.44 R31.1 84.46,91.44 81.92,88.9 81.92,83.19 IC2.12 C11.2 | R30.1 88.9,93.98 | C10.2 IC2.10 | C8.2 IC2.3 77.47,81.28 78.11,80.65 78.11,76.84 77.47,76.2 IC2.5 C9.2 | C19.2 IC3.3 129.54,81.28 | 129.54,81.28 129.54,77.15 128.59,76.2 IC3.5 C20.2 | 129.54,81.28 IC3.12 C22.2 C21.2 IC3.10
N$40
  Bottom 0.406: C14.2 IC2.8 R42.1 R48.2
N$41
  Bottom 0.406: R38.1 IC2.1 C12.2 78.11,86.36 79.38,85.09 79.38,69.22 R46.2
N$42
  Bottom 0.406: HTBT.A R26.1
N$43
  Bottom 0.406: R56.1 R61.2 116.84,83.82 | R60.2 116.84,83.82 | 116.84,83.82 C19.1
N$44
  Bottom 0.406: C10.1 93.98,73.66 R43.2 99.06,71.12 R35.1 R42.2
N$45
  Bottom 0.406: C23.1 121.92,86.36 R61.1 IC3.2
N$46
  Bottom 0.406: R44.1 IC2.14 C15.2 90.17,90.17 100.33,90.17 R49.2
N$47
  Bottom 0.406: R57.1 R63.2 116.84,73.66 | C20.1 116.84,73.66 | R62.2 116.84,73.66
N$48
  Bottom 0.406: C14.1 88.9,71.12 R43.1 IC2.9
N$49
  Bottom 0.406: C24.1 121.29,73.03 121.92,73.66 R63.1 IC3.6
N$50
  Bottom 0.406: C11.1 93.98,83.82 | 93.98,83.82 R45.2 R36.1 | R44.2 93.98,83.82
N$51
  Bottom 0.406: R62.1 IC3.7 C24.2 121.92,71.12 116.84,66.04 R69.2
N$52
  Bottom 0.406: 144.78,73.66 R65.2 R58.1 | 144.78,73.66 C21.1 | R64.2 144.78,73.66
N$53
  Bottom 0.406: C15.1 88.9,86.36 R45.1 IC2.13
N$55
  Bottom 0.406: C25.2 IC3.8 R64.1 R70.2
N$56
  Bottom 0.406: C25.1 139.7,71.12 R65.1 IC3.9
N$57
  Bottom 0.406: C22.1 144.78,83.82 | R59.1 R67.2 144.78,83.82 | R66.2 144.78,83.82
N$58
  Bottom 0.406: C26.1 139.7,86.36 R67.1 IC3.13
N$59
  Bottom 0.406: IC3.14 C26.2 | R66.1 IC3.14 | R71.2 151.13,80.01 140.33,80.01 137.79,82.55 133.35,82.55 132.08,83.82 132.08,85.41 133.03,86.36 IC3.14
N$60
  Bottom 0.406: T45.1 119.38,93.98 R53.2 111.76,91.44 109.22,88.9 R57.2
N$61
  Bottom 0.406: T43.1 111.76,99.06 R56.2 R52.2
N$62
  Bottom 0.406: T47.1 129.54,96.52 R54.2 139.7,91.44 140.97,90.17 149.86,90.17 152.4,87.63 R58.2
N$63
  Bottom 0.406: R55.2 R59.2 C18.+
N$64
  Bottom 0.406: IC2.4 C16.1 67.31,72.39 67.31,67.31 D3.A 68.58,63.5 R50.1 69.85,59.69 97.79,59.69 100.33,62.23 100.33,64.77 106.68,71.12 106.68,74.93 109.22,77.47 123.19,77.47 C17.1 IC3.4
N$65
  Bottom 0.406: R60.1 IC3.1 C23.2 120.65,90.17 114.94,90.17 110.49,85.73 110.49,83.19 109.86,82.55 105.41,82.55 R68.2
N$66
  Bottom 0.406: T37.1 71.12,99.06 71.12,93.98 R29.2 66.04,91.44 58.42,83.82 58.42,81.28 R34.2
N$67
  Bottom 0.406: C13.2 IC2.7 R40.1 72.39,64.77 72.39,62.23 R47.2
N$68
  Top 0.406: R7.1 15.24,43.18 R9.E
N$70
  Bottom 0.406: R3.2 SV4.3
N$71
  Bottom 0.406: Q1.2 119.38,25.4 R3.1 127,22.86 R2.2
N$72
  Bottom 0.406: R24.1 PUB.A
N$73
  Bottom 0.406: R25.1 SUB.A
PA6
  Bottom 0.406: SV7.28 85.09,24.13 JP1.1
PA7
  Bottom 0.406: SV7.27 67.95,25.4 JP3.1
PB5  (via drill 0.6)
  Top 0.406: v109.22,48.26 FEATURE-CONN.10
  Bottom 0.406: SV1.4 146.37,26.35 124.46,48.26 v109.22,48.26
PB6  (via drill 0.6)
  Top 0.406: v109.22,50.8 FEATURE-CONN.8
  Bottom 0.406: SV1.5 148.91,26.35 124.46,50.8 v109.22,50.8
PC0
  Bottom 0.406: SV7.19 73.66,35.56 R26.2
PC1
  Top 0.406: R16.2 48.26,36.2 43.18,41.27 IC1.1
  Bottom 0.406: SV7.20 85.09,34.29 81.92,34.29 78.11,30.48 59.69,30.48 46.99,43.18 IC1.1
PC2
  Top 0.406: R17.2 41.91,31.75 41.91,40.01 40.64,41.27 IC1.2
  Bottom 0.406: SV7.21 81.92,33.02 78.74,29.84 59.05,29.84 48.26,40.64 41.27,40.64 40.64,41.27 IC1.2
PC3
  Top 0.406: R18.2 36.83,31.75 36.83,40.01 38.1,41.27 IC1.3
  Bottom 0.406: SV7.22 85.09,31.75 81.92,31.75 79.38,29.21 58.42,29.21 47.62,40.01 39.37,40.01 38.1,41.27 IC1.3
PC4
  Top 0.406: R19.2 34.29,31.75 34.29,40.01 35.56,41.27 IC1.4
  Bottom 0.406: SV7.23 81.92,30.48 80.01,28.57 57.78,28.57 46.99,39.37 37.46,39.37 35.56,41.27 IC1.4
PC5
  Top 0.406: R20.2 29.21,31.75 29.21,37.46 33.02,41.27 IC1.5
  Bottom 0.406: SV7.24 85.09,29.21 81.92,29.21 80.65,27.94 57.15,27.94 46.35,38.73 35.56,38.73 33.02,41.27 IC1.5
PC6
  Top 0.406: R21.2 26.67,34.29 26.67,37.46 30.48,41.27 IC1.6
  Bottom 0.406: SV7.25 81.92,27.94 81.28,27.3 56.52,27.3 45.72,38.1 33.66,38.1 30.48,41.27 IC1.6
PC7
  Top 0.406: IC1.7 27.94,41.27 26.67,40.01 24.77,40.01 17.78,33.02 R22.2
  Bottom 0.406: SV7.26 85.09,26.67 55.88,26.67 45.09,37.46 31.11,37.46 27.94,40.64 IC1.7
PD7
  Bottom 0.406: SV7.18 85.09,36.83 74.93,36.83 68.58,43.18 R25.2
PG0
  Bottom 0.406: J1.1 J2.1 J3.1 J4.1 78.74,40.64 SV7.15
PG1
  Bottom 0.406: SV7.16 85.09,39.37 76.2,39.37 71.12,44.45 71.12,53.34 R23.2
PG2
  Bottom 0.406: SV7.17 75.57,38.1 69.85,43.81 69.85,49.53 R24.2
PL0
  Bottom 0.406: J8.1 77.47,52.07 82.55,52.07 SV7.7
PL1
  Bottom 0.406: J7.1 77.47,49.53 85.09,49.53 SV7.8
PL2
  Bottom 0.406: J6.1 76.2,47.62 76.84,46.99 79.38,46.99 80.65,48.26 SV7.9
PL3
  Bottom 0.406: J5.1 77.47,44.45 79.38,44.45 81.92,46.99 85.09,46.99 SV7.10
PL4
  Bottom 0.406: SV7.11 85.09,44.45 100.33,44.45 FEATURE-CONN.13
PL5
  Bottom 0.406: SV7.12 FEATURE-CONN.11
PL6
  Bottom 0.406: SV7.13 85.09,41.91 97.79,41.91 FEATURE-CONN.17
PL7
  Bottom 0.406: SV7.14 99.06,43.18 FEATURE-CONN.15
RESET
  Bottom 0.406: SV2.3 147.32,60.96 152.4,55.88 152.4,16.35 152.72,16.03 152.72,14.13 151.29,12.7 141.29,12.7 SV1.1
RXD1
  Top 0.406: SV6.3 100.33,16.51 100.33,31.75 102.87,34.29 102.87,36.83 FEATURE-CONN.18
RXD3
  Bottom 0.406: SV6.7 114.3,10.16 121.92,10.16 T12.1
SCK
  Bottom 0.406: SV7.4 87.63,54.61 102.87,54.61 FEATURE-CONN.6
SCL
  Bottom 0.406: R5.2 102.87,19.05 96.52,19.05 93.98,16.51 SV6.1 93.98,12.7 96.52,10.16 99.06,10.16 T16.1
SDA
  Bottom 0.406: R4.2 104.14,17.78 97.79,17.78 96.52,16.51 SV6.2 99.06,12.7 101.6,12.7 T15.1
SEL-TFT  (via drill 0.6)
  Top 0.406: v109.22,43.18 FEATURE-CONN.14
  Bottom 0.406: SV4.6 129.54,38.1 124.46,43.18 v109.22,43.18
SWITCH-1
  Bottom 0.406: R6.2 R8.1 93.98,17.78 93.35,17.78 91.44,15.88 91.44,10.16 T19.1
SWITCH-2
  Bottom 0.406: R12.2 R13.1 T23.1
TXD1
  Top 0.406: SV6.4 101.6,30.48 106.68,35.56 106.68,38.1 FEATURE-CONN.16

### Text on the board
Top: PWR-MON | TOP
Bottom: BOTTOM
tNames: 8 | 9 | 10 | 11 | S | T